# Altium project Arduino Uno R3_CP.PrjPcb
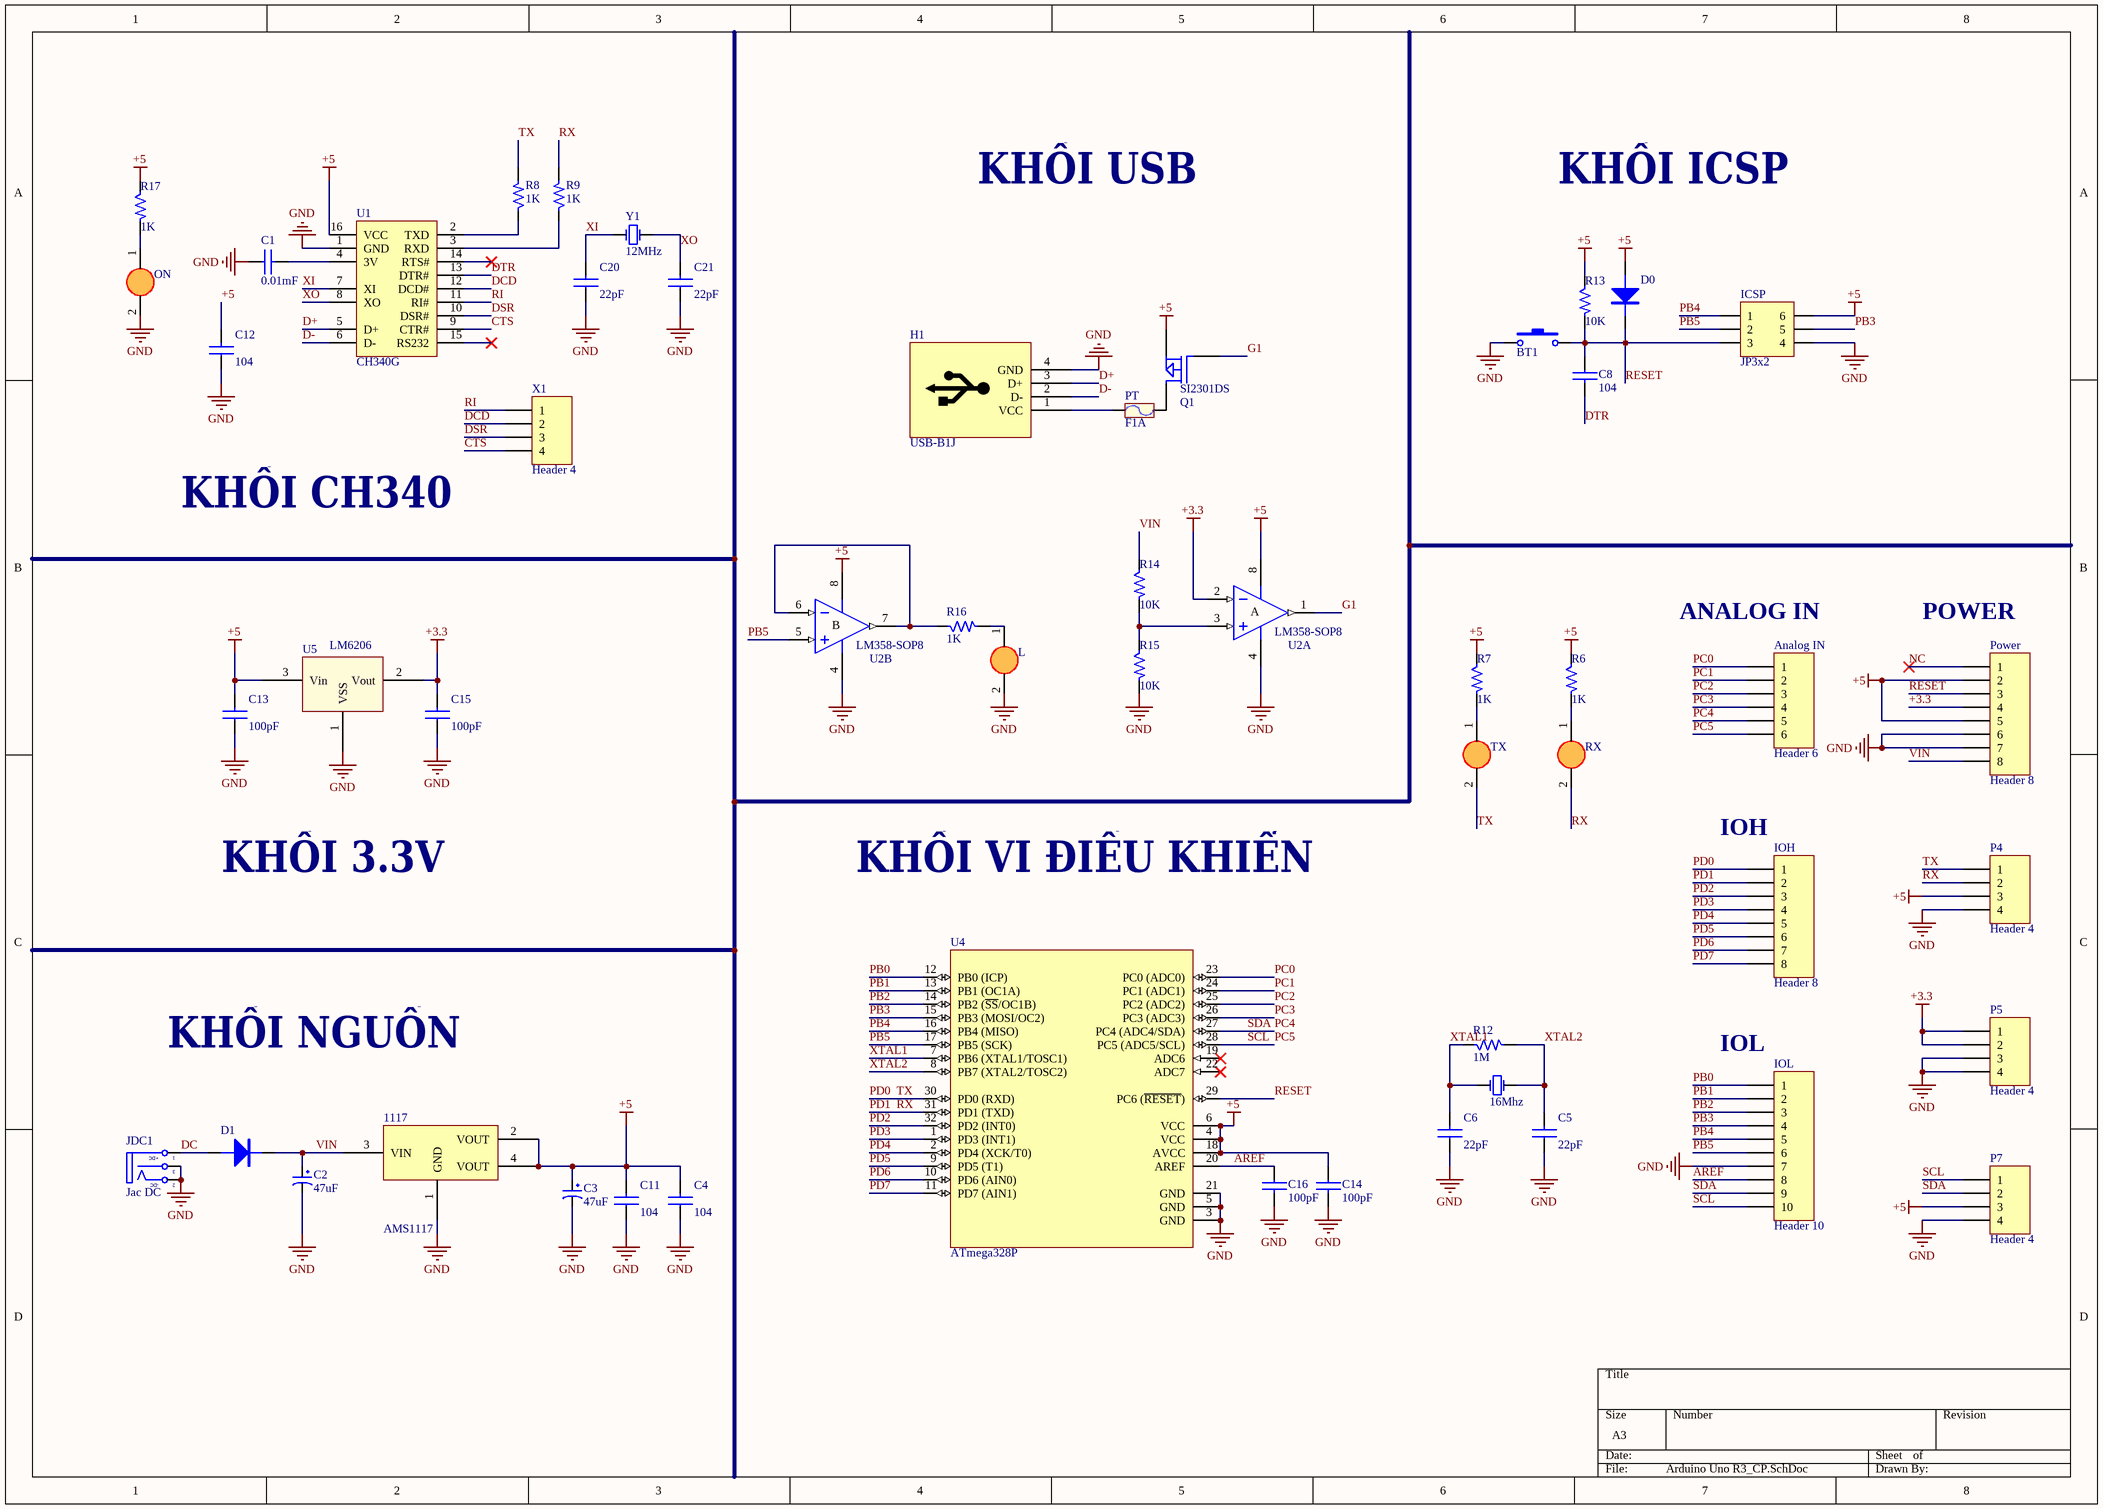
[diagram p0: Arduino Uno R3_CP.SchDoc]
1 sheet, 52 parts. Net scope: global (net labels, ports and power ports of the same name join across sheets).
Board file: Arduino Uno R3_CP.PcbDoc

## Sheet Arduino Uno R3_CP.SchDoc
size A3; SheetNumber: 1; SheetTotal: 1

### Parts
1117  AMS1117  [SOT223-4N]
Analog_IN  Header 6  [JP6-C1T]
BT1  Nut Nhan 2 Chan  [BT 4 PIN 6.2*6.2*3.1]  (value not drawn)
C1  0.01mF  [CN-SMD-0805]
C2  47uF  [CAP-ALU-SMD-5x5.5x1.4]
C3  47uF  [CAP-ALU-SMD-5x5.5x1.4]
C4  104  [CN-SMD-0805]
C5  22pF  [CN-SMD-0805]
C6  22pF  [CN-SMD-0805]
C8  104  [CN-SMD-0805]
C11  104  [CN-SMD-0805]
C12  104  [CN-SMD-0805]
C13  100pF  [CN-SMD-0805]
C14  100pF  [CN-SMD-0805]
C15  100pF  [CN-SMD-0805]
C16  100pF  [CN-SMD-0805]
C20  22pF  [CN-SMD-0805]
C21  22pF  [CN-SMD-0805]
D0  (no value)  [RES-SMD-1206]
D1  (no value)  [SMA]
H1  USB-B1J  [USB-B-STRANGE]
ICSP  JP3x2  [JP3-D2T]
IOH  Header 8  [JP8-C1T]
IOL  Header 10  [JP10-C1T]
JDC1  Jac DC  [DC-IN]
L  (no value)  [LED-0805-Red]
ON  (no value)  [LED-0805-Red]
P4  Header 4  [JP4-D1T]
P5  Header 4  [JP4-D1T]
P7  Header 4  [JP4-D1T]
Power  Header 8  [JP8-C1T]
PT  F1A  [FUSE-SMD-0805]
Q1  SI2301DS  [SOT23]
R6  1K  [RES-SMD-0805]
R7  1K  [RES-SMD-0805]
R8  1K  [RES-SMD-0805]
R9  1K  [RES-SMD-0805]
R12  1M  [RES-SMD-0805]
R13  10K  [RES-SMD-0805]
R14  10K  [RES-SMD-0805]
R15  10K  [RES-SMD-0805]
R16  1K  [RES-SMD-0805]
R17  1K  [RES-SMD-0805]
RX  (no value)  [LED-0805-Red]
TX  (no value)  [LED-0805-Red]
U1  CH340G  [SO16]
U2  LM358-SOP8  [SO8]  (parts A,B of 2)
U4  ATmega328P  [TQFP32]
U5  LM6206  [SOT23]
X1  Header 4  [HDR1X4]
Y1  12MHz  [XTAL-RU49/4]
Y2  16Mhz  [XTAL-RU49/4]

### Nets
+3.3: C15.2 P5.1 P5.2 Power.4 U2.2(IN-) U5.2(Vout)
+5: 1117.2(VOUT) 1117.4(VOUT) C3.1 C4.2 C11.2 C12.2 C13.2 C14.1 D0.1 ICSP.6 P4.3 P7.3 Power.2 Power.5 Q1.3(S) R6.1 R7.1 R13.1 R17.1 U1.16(VCC) U2.8(V+) U4.4(VCC) U4.6(VCC) U4.18(AVCC) U5.3(Vin)
GND: 1117.1(GND) BT1.1 C1.1 C2.2 C3.2 C4.1 C5.1 C6.1 C11.1 C12.1 C13.1 C14.2 C15.1 C16.2 C20.1 C21.1 H1.4(GND) ICSP.4 IOL.7 JDC1.2(TN) JDC1.3(S) L.2(K) ON.2(K) P4.4 P5.3 P5.4 P7.4 Power.6 Power.7 R15.2 U1.1(GND) U2.4(V-) U4.3(GND) U4.5(GND) U4.21(GND) U5.1(VSS)
AREF: C16.1 IOL.8 U4.20(AREF)
CTS: U1.9(CTR#) X1.4
D+: H1.3(D+) U1.5(D+)
D-: H1.2(D-) U1.6(D-)
DC: D1.1 JDC1.1(T)
DCD: U1.12(DCD#) X1.2
DSR: U1.10(DSR#) X1.3
DTR: C8.2 U1.13(DTR#)
G1: Q1.1(G) U2.1(OUT)
NC: Power.1
PB0: IOL.1 U4.12(PB0_(ICP))
PB1: IOL.2 U4.13(PB1_(OC1A))
PB2: IOL.3 U4.14(PB2_(~{SS}/OC1B))
PB3: ICSP.5 IOL.4 U4.15(PB3_(MOSI/OC2))
PB4: ICSP.1 IOL.5 U4.16(PB4_(MISO))
PB5: ICSP.2 IOL.6 U2.5(IN+) U4.17(PB5_(SCK))
PC0: Analog_IN.1 U4.23(PC0_(ADC0))
PC1: Analog_IN.2 U4.24(PC1_(ADC1))
PC2: Analog_IN.3 U4.25(PC2_(ADC2))
PC3: Analog_IN.4 U4.26(PC3_(ADC3))
PC4: Analog_IN.5 IOL.9 P7.2 U4.27(PC4_(ADC4/SDA))  [also labelled SDA]
PC5: Analog_IN.6 IOL.10 P7.1 U4.28(PC5_(ADC5/SCL))  [also labelled SCL]
PD0: IOH.1 P4.1 R8.2 TX.2(K) U4.30(PD0_(RXD))  [also labelled TX]
PD1: IOH.2 P4.2 R9.2 RX.2(K) U4.31(PD1_(TXD))  [also labelled RX]
PD2: IOH.3 U4.32(PD2_(INT0))
PD3: IOH.4 U4.1(PD3_(INT1))
PD4: IOH.5 U4.2(PD4_(XCK/T0))
PD5: IOH.6 U4.9(PD5_(T1))
PD6: IOH.7 U4.10(PD6_(AIN0))
PD7: IOH.8 U4.11(PD7_(AIN1))
RESET: BT1.2 C8.1 D0.2 ICSP.3 Power.3 R13.2 U4.29(PC6_(~{RESET}))
RI: U1.11(RI#) X1.1
VIN: 1117.3(VIN) C2.1 D1.2 Power.8 R14.1
XI: C20.2 U1.7(XI) Y1.1(OSC1)
XO: C21.2 U1.8(XO) Y1.2(OSC2)
XTAL1: C6.2 R12.1 U4.7(PB6_(XTAL1/TOSC1)) Y2.1(OSC1)
XTAL2: C5.2 R12.2 U4.8(PB7_(XTAL2/TOSC2)) Y2.2(OSC2)
NetC1_2: C1.2 U1.4(3V)
NetH1_1: H1.1(VCC) PT.1
NetL_1: L.1(A) R16.2
NetON_1: ON.1(A) R17.2
NetPT_2: PT.2 Q1.2(D)
NetR6_2: R6.2 RX.1(A)
NetR7_2: R7.2 TX.1(A)
NetR8_1: R8.1 U1.2(TXD)
NetR9_1: R9.1 U1.3(RXD)
NetR14_2: R14.2 R15.1 U2.3(IN+)
NetR16_1: R16.1 U2.6(IN-) U2.7(OUT)

Not connected (* = marked no-connect by the designer): H1 5 6; U1 14(RTS#)* 15(RS232)*; U4 19(ADC6)* 22(ADC7)*

### Notes on the sheet
- KHỐI USB
- KHỐI ICSP
- KHỐI CH340
- (near Analog_IN) ANALOG IN
- (near Power) POWER
- (near IOH) IOH
- KHỐI 3.3V
- KHỐI VI ĐIỀU KHIỂN
- KHỐI NGUỒN
- (near IOL) IOL
- (in symbol DCIN) +DC; -DC
- (in symbol LM358-SOP8, part A) A
- (in symbol LM358-SOP8, part B) B

### Library data of the parts
1117 = AMS1117: AMS
Analog_IN = Header 6: Header, 6-Pin; LatestRevisionDate: 17-Jul-2002; LatestRevisionNote: Re-released for DXP Platform.; Publisher: Altium Limited
C1 C4-C6 C8 C11-C16 C20 C21 = Tu 0805: Right: 20; Bottom: 10
C2 C3 = CP1: Cap P  0,1uF < 22uF , 16 - 50V; Value: 10uF/50V; Description 1: 10 => 220uF/6,3V/10V - 10uF => 100uF/16V; Description 2: 0,1uF => 33uF/50V - 10uF => 22uF/63V; Description 3: 0,47uF => 10uF/100V
D0 D1 = Diode SS14 DO214 Schottky 1A 40V ( 1N5819 DO214)_MH: Diode SS14 DO214 Schottky 1A 40V ( 1N5819 DO214)
H1 = USB: USB conector
ICSP = JP3x2_3: WR-PHD 2.54 mm Dual Socket Header; Manufacturer: W¨¹rth Elektronik eiSos GmbH; partNo: 61300621821; ComponentLink1 Description: Manufacturer; ComponentLink2 Description: Datasheet; NoPins: 06; Created Date: 29 March 2013; ComponentLink1URL: http://www.we-online.com; ComponentLink2URL: http://katalog.we-online.de/em/datasheet/6130xx21821.pdf; Created by: Karrer Zheng
IOH Power = Header 8: Header, 8-Pin; LatestRevisionDate: 17-Jul-2002; LatestRevisionNote: Re-released for DXP Platform.; Publisher: Altium Limited
IOL = Header 10: Header, 10-Pin; LatestRevisionDate: 17-Jul-2002; LatestRevisionNote: Re-released for DXP Platform.; Publisher: Altium Limited
JDC1 = DCIN: Jac DC input; Value: Jac DC
L ON RX TX = LED SMD_0805_MH: LED 3mm
P4 P5 P7 X1 = Header 4: Header, 4-Pin; LatestRevisionDate: 17-Jul-2002; LatestRevisionNote: Re-released for DXP Platform.; Publisher: Altium Limited
PT = Fuse: Designed by: VanDungEvn; Value: Fuse
Q1 = MOSFET P
R6-R9 R12-R17 = Tro 0805: Value: R1/4W - 1K
U1 = CH340G: High and Low Side Driver; Note: Pins 4, 8 and 14 are not connected; Published: 8-Jun-2000; LatestRevisionDate: 04-Mar-2005; LatestRevisionNote: Stylized 3D Model Added.; DatasheetVersion: PD60147J; PackageReference: PDIP14; Publisher: Altium Limited; PackageDescription: DIP; 14 Leads; Row Spacing 7.62 mm; Pitch 2.54 mm; ComponentLink1Description: Manufacturer Link; ComponentLink1URL: http://www.irf.com/; ComponentLink2Description: Datasheet; ComponentLink2URL: http://www.irf.com/product-info/datasheets/data/ir2110.pdf
U2 = LM358-SOP8: Dual Low-Power Operational Amplifier; Published: 24-Aug-2001; LatestRevisionDate: 13-Apr-2006; LatestRevisionNote: IPC-7351 Footprint Added.; PackageVersion: Dec-2002; PackageReference: SO8; Publisher: Altium Limited; PackageDescription: 8-Pin Small Outline Integrated Circuit 1.27 mm Pitch; Code_JEDEC: MS-012-AA; Code_IPC: SOIC127P600-8; ComponentLink1Description: Manufacturer Link; ComponentLink1URL: http://www.st.com/; ComponentLink2Description: Datasheet; ComponentLink2URL: http://www.st.com/stonline/products/literature/ds/2163/lm358.pdf
U4 = ATmega8-16AC: 8-Bit AVR Microcontroller with 8K Bytes of In-System Programmable Flash Memory; Published: 17-Sep-2003; LatestRevisionDate: 13-Apr-2006; LatestRevisionNote: IPC-7351 Footprint Added.; DatasheetVersion: 2486H-AVR-09/02; PackageVersion: revB, Oct-2001; PackageReference: 32A; Publisher: Altium Limited; PackageDescription: 32-Pin Thin Quad Flat Pack 0.8 mm Pitch; Code_JEDEC: MS-026-ABA; ComponentLink1Description: Manufacturer Link; ComponentLink1URL: http://www.atmel.com; ComponentLink2Description: Datasheet; ComponentLink2URL: http://www.atmel.com/dyn/resources/prod_documents/doc2486.pdf
U5 = xc6206
Y1 = CRYSTAL 12MHz
Y2 = Crystal: Crystal Oscillator; Published: 8-Jun-2000; LatestRevisionDate: 17-Jul-2002; LatestRevisionNote: Re-released for DXP Platform.; PackageReference: R38; Publisher: Altium Limited
BT1 = Nut Nhan 2 Chan: Published: 24-Mar-1999; LatestRevisionDate: 17-Jul-2002; LatestRevisionNote: Re-released for DXP Platform.; PackageReference: SPST-2; Publisher: Altium Limited